# Altium project NewPower.PrjPcb
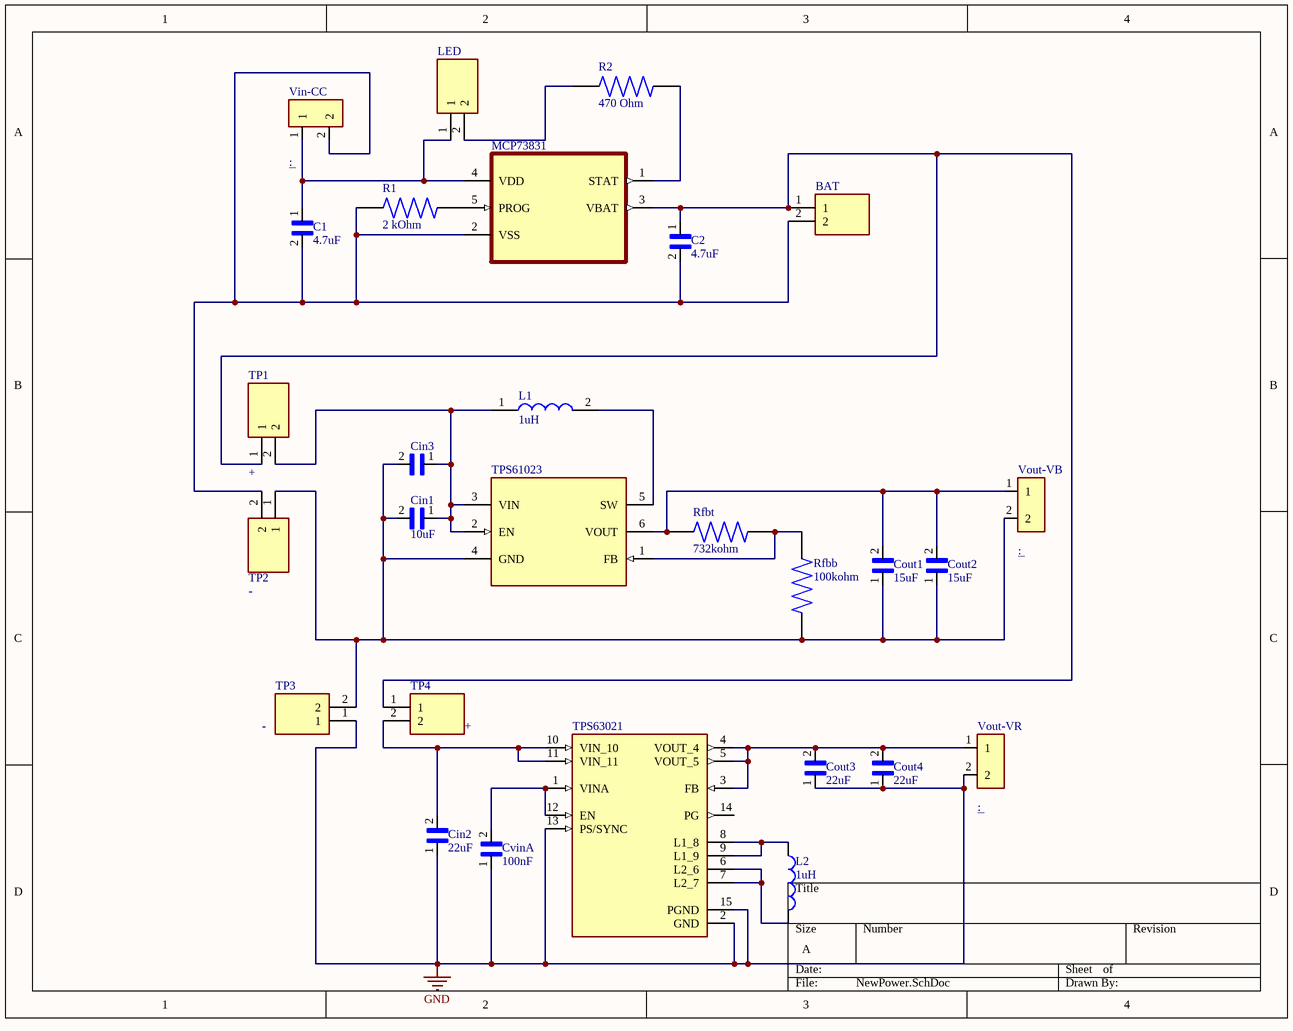
[diagram p0: NewPower.SchDoc]
1 sheet, 28 parts. Net scope: global (net labels, ports and power ports of the same name join across sheets).
Board file: NewPower.PcbDoc

## Sheet NewPower.SchDoc
size A; SheetNumber: 1; SheetTotal: 1

### Parts
BAT  (no value)  [JST_S2B-PH-K-S(LF)(SN)]
C1  4.7uF  [CAPC1005X55N]
C2  4.7uF  [CAPC1005X55N]
Cin1  10uF  [CAPC2012X88N]
Cin2  22uF  [CAPC1608X100N]
Cin3  (no value)  [CAPC2012X88N]
Cout1  15uF  [CAPC2012X145N]
Cout2  15uF  [CAPC2012X145N]
Cout3  22uF  [CAPC1608X100N]
Cout4  22uF  [CAPC1608X100N]
CvinA  100nF  [CAPC1608X90N]
L1  1uH  [74438357010]
L2  1uH  [INDC2016X100N]
LED  (no value)  [HDRV2W60P0X200_1X2_400X200X525P]
MCP73831  (no value)  [SOT95P280X145-5N]
R1  2 kOhm  [RESC3116X65N]
R2  470 Ohm  [RESC3116X65N]
Rfbb  100kohm  [RESC1508X50N]
Rfbt  732kohm  [RESC1508X50N]
TP1  +  [HDRV2W60P0X200_1X2_400X200X525P]
TP2  -  [HDRV2W60P0X200_1X2_400X200X525P]
TP3  -  [HDRV2W60P0X200_1X2_400X200X525P]
TP4  +  [HDRV2W60P0X200_1X2_400X200X525P]
TPS61023  (no value)  [DRL0006A]
TPS63021  (no value)  [IC_TPS63021DSJR]
Vin-CC  (no value)  [WE_691211720002]
Vout-VB  (no value)  [WE_691211720002]
Vout-VR  (no value)  [WE_691211720002]

### Nets
GND: Cin2.1 Cout3.1 Cout4.1 CvinA.1 TP3.1 TPS63021.2(GND) TPS63021.13(PS/SYNC) TPS63021.15(PGND) Vout-VR.2
NetBAT_1: BAT.1 C2.1 MCP73831.3(VBAT) TP1.1 TP4.1
NetBAT_2: BAT.2 C1.2 C2.2 MCP73831.2(VSS) R1.1 TP2.2 Vin-CC.2
NetC1_1: C1.1 LED.1 MCP73831.4(VDD) Vin-CC.1
NetCin1_1: Cin1.1 Cin3.1 L1.1 TP1.2 TPS61023.2(EN) TPS61023.3(VIN)
NetCin1_2: Cin1.2 Cin3.2 Cout1.1 Cout2.1 Rfbb.1 TP2.1 TP3.2 TPS61023.4(GND) Vout-VB.2
NetCin2_2: Cin2.2 TP4.2 TPS63021.10(VIN_10) TPS63021.11(VIN_11)
NetCout1_2: Cout1.2 Cout2.2 Rfbt.1 TPS61023.6(VOUT) Vout-VB.1
NetCout3_2: Cout3.2 Cout4.2 TPS63021.3(FB) TPS63021.4(VOUT_4) TPS63021.5(VOUT_5) Vout-VR.1
NetCvinA_2: CvinA.2 TPS63021.1(VINA) TPS63021.12(EN)
NetL1_2: L1.2 TPS61023.5(SW)
NetL2_1: L2.1 TPS63021.8(L1_8) TPS63021.9(L1_9)
NetL2_2: L2.2 TPS63021.6(L2_6) TPS63021.7(L2_7)
NetLED_2: LED.2 R2.1
NetMCP73831_1: MCP73831.1(STAT) R2.2
NetMCP73831_5: MCP73831.5(PROG) R1.2
NetRfbb_2: Rfbb.2 Rfbt.2 TPS61023.1(FB)

Not connected (* = marked no-connect by the designer): TPS63021 14(PG)

### Library data of the parts
BAT = S2B-PH-K-S(LF)(SN): Connector Header Through Hole, Right Angle 2 position; MF: JST Sales America Inc.; Price: None; Availability: In Stock; Package: None; MP: S2B-PH-K-S(LF)(SN); Value: *; SnapEDA_Link: https://www.snapeda.com/parts/S2B-PH-K-S(LF)(SN)/JST+Sales+America+Inc./view-part/?ref=snap; Purchase-URL: https://pricing.snapeda.com/search/part/S2B-PH-K-S(LF)(SN)/?ref=eda; Check_prices: https://www.snapeda.com/parts/S2B-PH-K-S(LF)(SN)/JST+Sales+America+Inc./view-part/?ref=eda
C1 C2 = CL05A475MP5NRNC: 4.7ÂµF Â±20% 10V Ceramic Capacitor X5R 0402 (1005 Metric); MF: Samsung Electro-Mechanics; DigiKey-Purchase-URL: https://snapeda.com/shop?store=DigiKey&id=2751704; Package: 0402 Samsung; MP: CL05A475MP5NRNC; Value: *; Digi-Key_Part_Number: 1276-1482-1-ND; SnapEDA_Link: https://www.snapeda.com/parts/CL05A475MP5NRNC/Samsung%20Electro-Mechanics/view-part/2751704/?ref=snap
Cin1 Cin3 = C0805C106K8PACTU: 10Î¼F Â± 10% Capacitor de cerÃ¢mica 10V X5R 0805 _2012 MÃ©trico_; MF: KEMET; Digi-Key_Part_Number: 399-4925-1-ND; SnapEDA_Link: https://www.snapeda.com/parts/C0805C106K8PACTU/KEMET/view-part/1479348/?ref=snap; Package: 0805 KEMET; MP: C0805C106K8PACTU; Digi-Key_Purchase_URL: https://www.digikey.com.br/product-detail/en/kemet/C0805C106K8PACTU/399-4925-1-ND/1090920?utm_source=snapeda&utm_medium=aggregator&utm_campaign=symbol; Value: *
Cin2 Cout3 Cout4 = GRM188R60J226MEA0D: SMD Capacitor X5R_EIA_ with Capacitance: 22uF Tol. 20%. Rated Voltage: 6.3Vdc; MF: Murata; Digi-Key_Purchase_URL: https://www.digikey.com/product-detail/en/murata-electronics/GRM188R60J226MEA0D/490-7611-1-ND/4280544?utm_source=snapeda&utm_medium=aggregator&utm_campaign=symbol; Digi-Key_Part_Number: 490-7611-1-ND; Package: 1608 Murata; SnapEDA_Link: https://www.snapeda.com/parts/GRM188R60J226MEA0D/Murata/view-part/4379901/?ref=snap; MP: GRM188R60J226MEA0D; Value: *
Cout1 Cout2 = C2012X5R1V156M125AC: 15ÂµF Â±20% 35V Ceramic Capacitor X5R 0805 (2012 Metric); MF: TDK; Check_prices: https://www.snapeda.com/parts/C2012X5R1V156M125AC/TDK-Lambda+Americas+Inc/view-part/?ref=eda; Value: *; Purchase-URL: https://pricing.snapeda.com/search/part/C2012X5R1V156M125AC/?ref=eda; Package: 2012 TDK; MP: C2012X5R1V156M125AC; SnapEDA_Link: https://www.snapeda.com/parts/C2012X5R1V156M125AC/TDK-Lambda+Americas+Inc/view-part/?ref=snap
CvinA = EMK107B7104KA-T: 0.1ÂµF Â±10% 16V Ceramic Capacitor X7R 0603 _1608 Metric_; MF: Taiyo Yuden; Value: *; MP: EMK107B7104KA-T; Package: 1608 Taiyo Yuden; Availability: Unavailable; SnapEDA_Link: https://www.snapeda.com/parts/EMK107B7104KA-T/Taiyo%20Yuden/view-part/588111/?ref=snap; Price: None
L1 = 74438357010: Inductor; Manufacturer_Name: Wurth Elektronik; Datasheet Link: https://katalog.we-online.de/pbs/datasheet/74438357010.pdf; Height: 3.1mm; Manufacturer_Part_Number: 74438357010; Mouser Part Number: 710-74438357010; Mouser Price/Stock: https://www.mouser.co.uk/ProductDetail/Wurth-Elektronik/74438357010?qs=AQlKX63v8RstGPuQmrueWg%3D%3D
L2 = DFE201610E-1R0M=P2: Inductor with Inductance: 1uH Tol. +/-20%, Package: 0806 (2016); MF: Murata Electronics; Digi-Key_Part_Number: 490-18106-2-ND; SnapEDA_Link: https://www.snapeda.com/parts/DFE201610E-1R0M=P2/Murata+Electronics+North+America/view-part/?ref=snap; MP: DFE201610E-1R0M=P2; Value: *; Check_prices: https://www.snapeda.com/parts/DFE201610E-1R0M=P2/Murata+Electronics+North+America/view-part/?ref=eda; Package: 0806-2 Murata; Purchase-URL: https://pricing.snapeda.com/search/part/DFE201610E-1R0M=P2/?ref=eda
LED TP1-TP4 = M22-2510205: Connector; Manufacturer_Name: Harwin; Datasheet Link: https://cdn.harwin.com/pdfs/M22-251.pdf; Height: 5.25mm; Manufacturer_Part_Number: M22-2510205; Mouser Part Number: 855-M22-2510205; Mouser Price/Stock: https://www.mouser.co.uk/ProductDetail/Harwin/M22-2510205?qs=vF78I%252BjhbY%2FHssMovH2Mxg%3D%3D
MCP73831 = MCP73831T-2ACI/OT: Charger IC Lithium Ion/Polymer SOT-23-5; MF: Microchip; Package: SOT-23 Microchip; Purchase-URL: https://pricing.snapeda.com/search/part/MCP73831T-2ACI/OT/?ref=eda; MP: MCP73831T-2ACI/OT; Value: *; Availability: In Stock; SnapEDA_Link: https://www.snapeda.com/parts/MCP73831T-2ACI/OT/Microchip/view-part/?ref=snap; Price: None; Check_prices: https://www.snapeda.com/parts/MCP73831T-2ACI/OT/Microchip/view-part/?ref=eda
R1 = RC1206FR-072KL: MF: Yageo; Value: *; SnapEDA_Link: https://www.snapeda.com/parts/RC1206FR-072KL/Yageo/view-part/1118481/?ref=snap; Digi-Key_Purchase_URL: https://www.digikey.com/product-detail/en/yageo/RC1206FR-072KL/311-2.00KFRCT-ND/731559?utm_source=snapeda&utm_medium=aggregator&utm_campaign=symbol; MP: RC1206FR-072KL; Digi-Key_Part_Number: 311-2.00KFRCT-ND; Package: 3116 Yageo
R2 = RC1206FR-07470RL: 470 Ohms Â±1% 0.25W, 1/4W Chip Resistor 1206 (3216 Metric) Thick Film; MF: Yageo; Check_prices: https://www.snapeda.com/parts/RC1206FR-07470RL/Yageo/view-part/422506/?ref=eda; Value: *; MP: RC1206FR-07470RL; Purchase-URL: https://pricing.snapeda.com/search/part/RC1206FR-07470RL/?ref=eda; SnapEDA_Link: https://www.snapeda.com/parts/RC1206FR-07470RL/Yageo/view-part/422506/?ref=snap; Package: 3116 Yageo
Rfbb = CRCW0603100KFKEA: 100 kOhms Â±1% 0.1W, 1/10W Chip Resistor 0603 (1608 Metric) Automotive AEC-Q200 Thick Film; MF: Vishay; SnapEDA_Link: https://www.snapeda.com/parts/CRCW0603100KFKEA/Vishay%20Dale/view-part/53276/?ref=snap; Availability: Unavailable; MP: CRCW0603100KFKEA; Price: None; Package: 1508 Vishay; Value: *
Rfbt = CRCW0603732KFKEA: Res Thick Film 0603 732K Ohm 1% 1/10W Â±100ppm/Â°C Molded SMD SMD Paper T/R; Package: None; Price: None; Value: *; MP: CRCW0603732KFKEA; Availability: Unavailable
TPS61023 = TPS61023DRLR: 3-A boost converter with 0.5-V ultra-low input voltage 6-SOT-5X3 -40 to 125; MF: Texas Instruments; Value: *; Price: None; Package: SOT-5X3-6 Texas Instruments; Purchase-URL: https://pricing.snapeda.com/search/part/TPS61023DRLR/?ref=eda; MP: TPS61023DRLR; Availability: Warning; SnapEDA_Link: https://www.snapeda.com/parts/TPS61023DRLR/Texas%20Instruments/view-part/4653127/?ref=snap; Check_prices: https://www.snapeda.com/parts/TPS61023DRLR/Texas%20Instruments/view-part/4653127/?ref=eda
TPS63021 = TPS63021DSJR: High Efficiency Single Inductor Buck-Boost Converter with 4A Switch  <a href="https://snapeda.com/parts/TPS63021DSJR/Texas%20Instruments/view-part/?ref=eda">Buy Part</a> <a href="https://snapeda.com/parts/TPS63021DSJR/Texas%20Instruments/view-part/?ref=eda">Check prices</a> <a href="https://snapeda.com/parts/TPS63021DSJR/Texas%20Instruments/view-part/?ref=eda">Check prices</a>; Price: None; MP: TPS63021DSJR; Value: *; Availability: Unavailable; Package: None
Vin-CC Vout-VB Vout-VR = 691211720002: 2 Position Wire to Board Terminal Block 45Â° (135Â°) Angle with Board 0.197 (5.00mm) Through Hole; MF: Wurth Electronics; MP: 691211720002; SnapEDA_Link: https://www.snapeda.com/parts/691211720002/Wurth%20Electronics%20Inc./view-part/1741219/?ref=snap; DigiKey-Purchase-URL: https://snapeda.com/shop?store=DigiKey&id=1741219; Package: None; Mouser-Purchase-URL: https://snapeda.com/shop?store=Mouser&id=1741219; Value: *